# EAGLE schematic RS485_v1 (EAGLE 6.1)
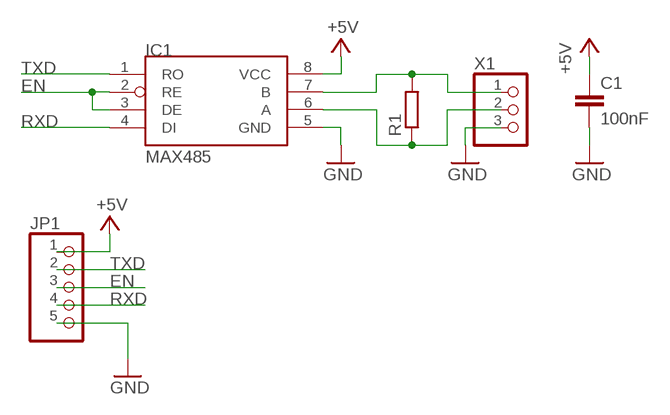
[diagram p0: schematic, sheet 1]

## Parts
C1  100nF  C-EUC0805K  [C0805K]
IC1  MAX485  [SO08]
JP1  PINHD-1X5  [1X05]
R1  R-EU_R0805  [R0805]
X1  W237-103  [W237-103]

## Nets
+5V: C1.1 IC1.8(VCC) JP1.1
EN: IC1.2(RE) IC1.3(DE) JP1.3
GND: C1.2 IC1.5(GND) JP1.5 X1.3
N$1: IC1.7(B) R1.2 X1.1
N$2: IC1.6(A) R1.1 X1.2
RXD: IC1.4(DI) JP1.4
TXD: IC1.1(RO) JP1.2

## Library data of the parts
C1 = mark_1:C-EU: CAPACITOR, European symbol
IC1 = mark_1:MAX485
JP1 = mark_1:PINHD-1X5: PIN HEADER
R1 = mark_1:R-EU_: RESISTOR, European symbol
X1 = mark_1:W237-103: WAGO SCREW CLAMP